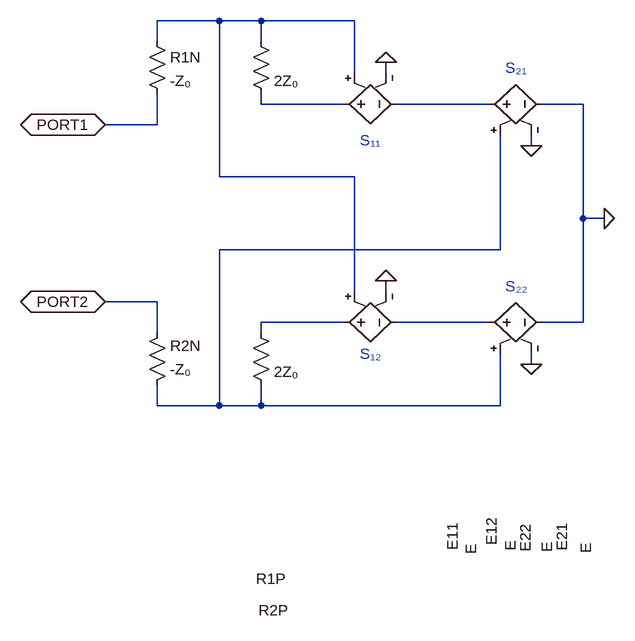
[diagram p0: schematic 2port.asc]
2port.asc, the LTspice schematic file:
Version 4
SHEET 1 912 1000
WIRE 304 80 208 80
WIRE 368 80 304 80
WIRE 512 80 368 80
WIRE 208 112 208 80
WIRE 368 112 368 80
WIRE 512 160 512 80
WIRE 560 160 560 144
WIRE 368 208 368 192
WIRE 496 208 368 208
WIRE 720 208 576 208
WIRE 864 208 800 208
WIRE 208 240 208 192
WIRE 208 240 128 240
WIRE 784 272 784 256
WIRE 304 320 304 80
WIRE 512 320 304 320
WIRE 864 384 864 208
WIRE 896 384 864 384
WIRE 736 432 736 256
WIRE 736 432 304 432
WIRE 512 496 512 320
WIRE 560 496 560 480
WIRE 208 512 128 512
WIRE 496 544 368 544
WIRE 720 544 576 544
WIRE 864 544 864 384
WIRE 864 544 800 544
WIRE 208 560 208 512
WIRE 368 560 368 544
WIRE 784 608 784 592
WIRE 208 672 208 640
WIRE 304 672 304 432
WIRE 304 672 208 672
WIRE 368 672 368 640
WIRE 368 672 304 672
WIRE 736 672 736 592
WIRE 736 672 368 672
FLAG 128 240 PORT1
IOPIN 128 240 BiDir
FLAG 128 512 PORT2
IOPIN 128 512 BiDir
FLAG 560 144 0
FLAG 784 608 0
FLAG 896 384 0
FLAG 560 480 0
FLAG 784 272 0
SYMBOL Res 192 96 R0
SYMATTR InstName R1N
SYMATTR Value -Z₀
SYMBOL Res 192 656 M180
WINDOW 0 36 76 Left 2
WINDOW 3 36 40 Left 2
SYMATTR InstName R2N
SYMATTR Value -Z₀
SYMBOL Res 352 96 R0
WINDOW 0 8 842 Left 2
SYMATTR InstName R1P
SYMATTR Value 2Z₀
SYMBOL Res 352 544 R0
WINDOW 0 12 443 Left 2
SYMATTR InstName R2P
SYMATTR Value 2Z₀
SYMBOL e 480 208 M90
WINDOW 0 644 183 Left 2
WINDOW 3 677 211 Left 2
SYMATTR InstName E11
SYMBOL e 704 208 R270
WINDOW 0 -679 19 Left 2
WINDOW 3 -688 48 Left 2
SYMATTR InstName E12
SYMBOL e 480 544 M90
WINDOW 0 309 351 Left 2
WINDOW 3 340 388 Left 2
SYMATTR InstName E21
SYMBOL e 704 544 R270
WINDOW 0 -353 71 Left 2
WINDOW 3 -354 104 Left 2
SYMATTR InstName E22
TEXT 520 264 Left 2 ;S₁₁
TEXT 744 152 Left 2 ;S₂₁
TEXT 520 592 Left 2 ;S₁₂
TEXT 744 488 Left 2 ;S₂₂

The netlist it stands for:
* 2port.asc
R1N N001 PORT1 -Z₀
R2N N004 PORT2 -Z₀
R1P N001 N002 2Z₀
R2P N005 N004 2Z₀
E11 N002 N003 N001 0 E
E12 N003 0 N004 0 E
E21 N005 N006 N001 0 E
E22 N006 0 N004 0 E
* S₁₁
* S₂₁
* S₁₂
* S₂₂
.backanno
.end